# EAGLE design membership box shield (EAGLE 6.4)
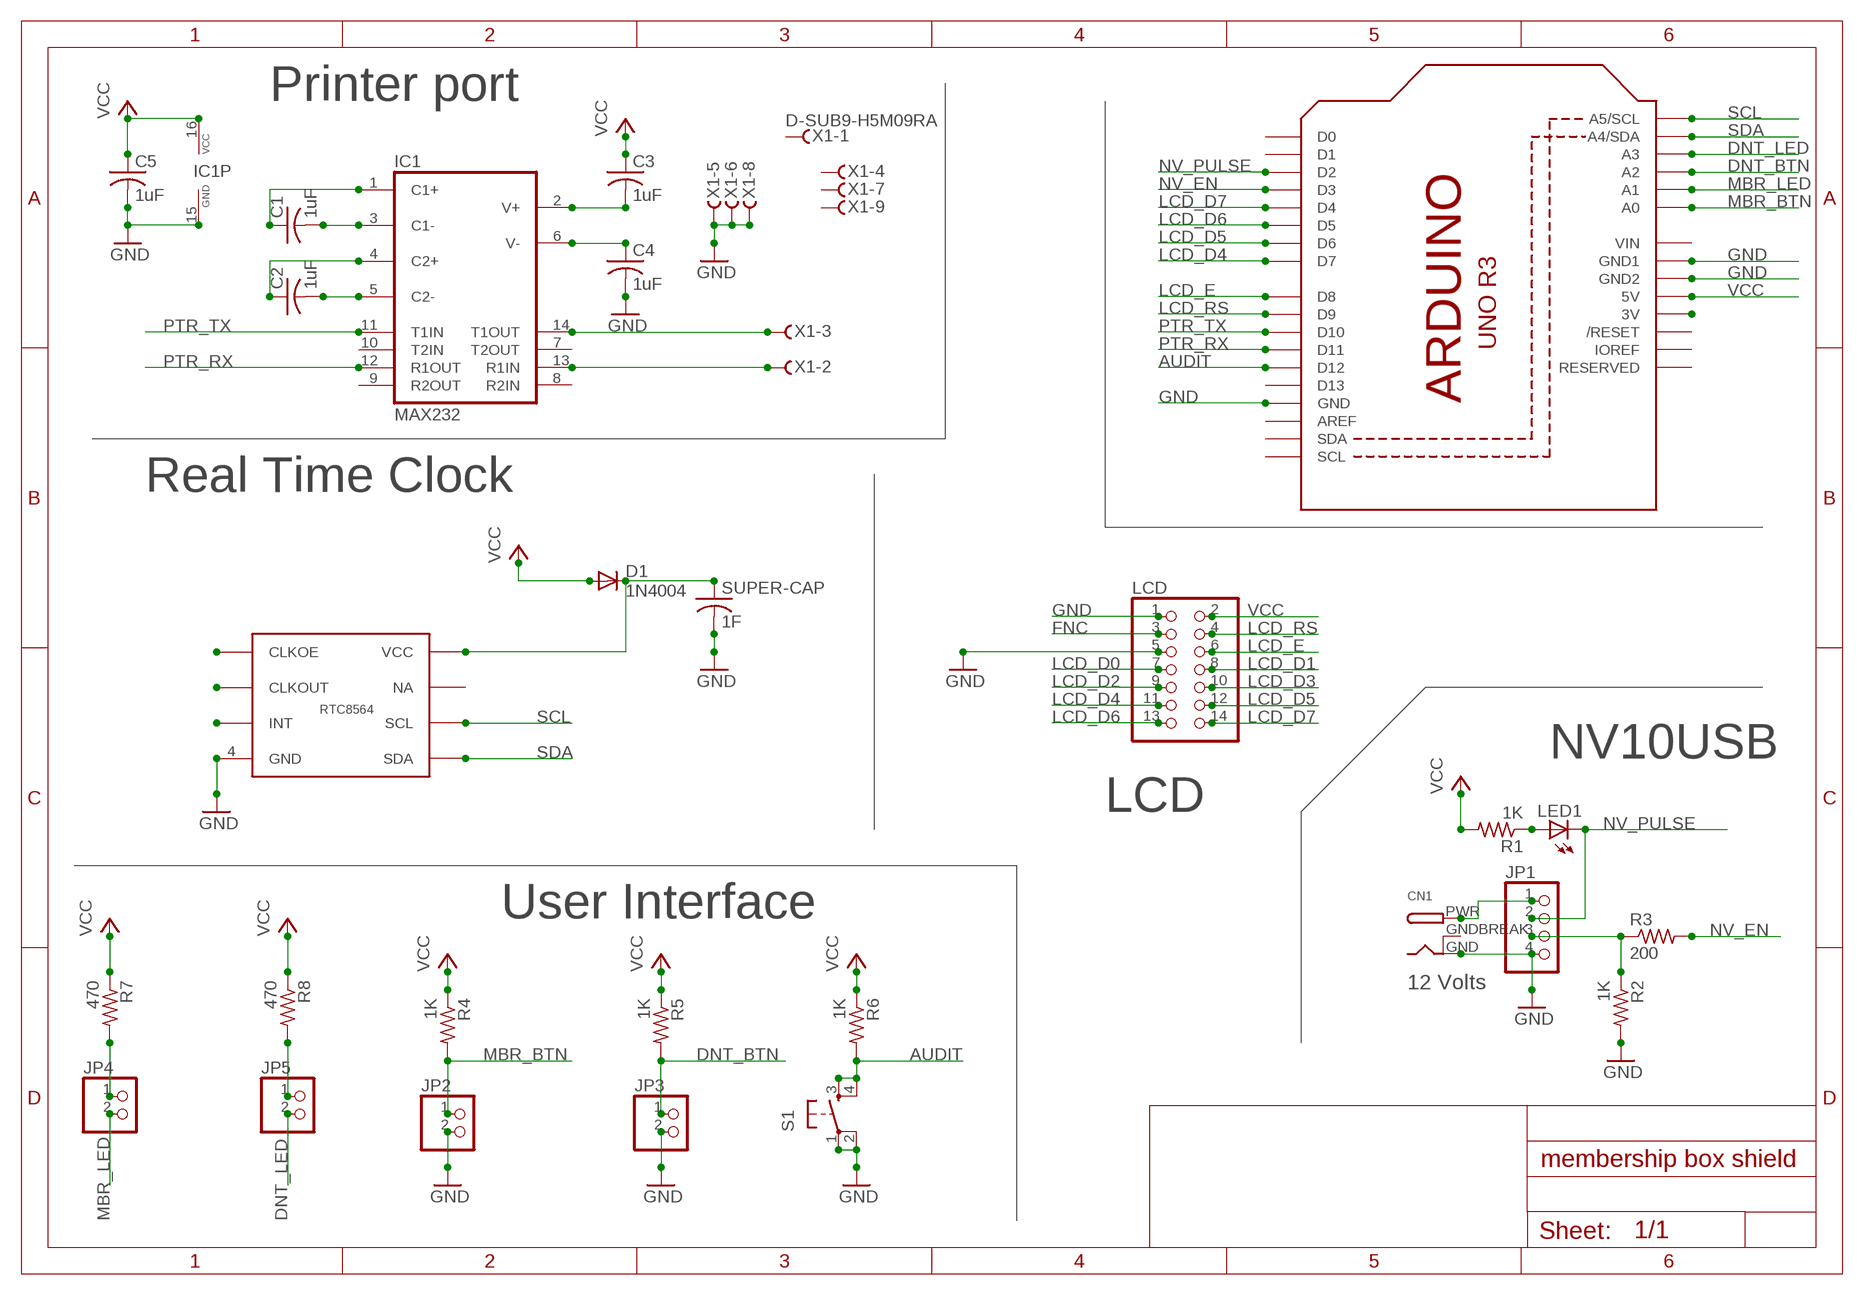
[diagram p0: schematic, sheet 1]

## Parts
C1  1uF  C-US025-024X044  [C025-024X044]
C2  1uF  C-US025-024X044  [C025-024X044]
C3  1uF  C-US025-024X044  [C025-024X044]
C4  1uF  C-US025-024X044  [C025-024X044]
C5  1uF  C-US025-024X044  [C025-024X044]
CN1  DCBARRELPTH  [DCJACK_2MM_PTH]
D1  1N4004  [DO41-10]
IC1  MAX232  [DIL16]
JP1  PINHD-1X4/90  [1X04/90]
JP2  PINHD-1X2  [1X02]
JP3  PINHD-1X2  [1X02]
JP4  PINHD-1X2  [1X02]
JP5  PINHD-1X2  [1X02]
LCD  PINHD-2X7  [2X07]
LED1  LED3MM  [LED3MM]
R1  1K  R-US_0204/2V  [0204V]
R2  1K  R-US_0204/2V  [0204V]
R3  200  R-US_0204/2V  [0204V]
R4  1K  R-US_0204/2V  [0204V]
R5  1K  R-US_0204/2V  [0204V]
R6  1K  R-US_0204/2V  [0204V]
R7  470  R-US_0204/2V  [0204V]
R8  470  R-US_0204/2V  [0204V]
RTC  RTC-8564_MODULE  [DIP-8]
S1  TAC_SWITCHPTH  [TACTILE-PTH]
SUPER-CAP  1F  C-US025-024X044  [C025-024X044]
U1  ARDUINOR3-DIMENSION  [ARDUINOR3]
X1  D-SUB9-H5M09RA  [H5M09RA]

## Nets
AUDIT: R6.2 S1.3 U1.D12
DNT_BTN: JP3.1 R5.2 U1.A2
DNT_LED: JP5.2 U1.A3
FNC: LCD.3
GND: C4.2 C5.2 CN1.GND IC1.15(GND) JP1.4 JP2.2 JP3.2 LCD.1 LCD.5 R2.2 RTC.4(GND) S1.1 S1.2 SUPER-CAP.2 U1.GND U1.GND1 U1.GND2 X1.5 X1.6 X1.8
LCD_D0: LCD.7
LCD_D1: LCD.8
LCD_D2: LCD.9
LCD_D3: LCD.10
LCD_D4: LCD.11 U1.D7
LCD_D5: LCD.12 U1.D6
LCD_D6: LCD.13 U1.D5
LCD_D7: LCD.14 U1.D4
LCD_E: LCD.6 U1.D8
LCD_RS: LCD.4 U1.D9
MBR_BTN: JP2.1 R4.2 U1.A0
MBR_LED: JP4.2 U1.A1
N$1: RTC.1(CLKOE)
N$2: RTC.2(CLKOUT)
N$3: RTC.3(INT)
N$4: JP1.3 R2.1 R3.1
N$5: C1.2 IC1.3(C1-)
N$7: LED1.A R1.1
N$8: D1.C RTC.8(VCC) SUPER-CAP.1
N$9: CN1.PWR JP1.1
N$10: C2.2 IC1.5(C2-)
N$11: IC1.13(R1IN) X1.2
N$12: JP4.1 R7.2
N$13: S1.4
N$14: JP5.1 R8.2
N$15: C1.1 IC1.1(C1+)
N$16: IC1.14(T1OUT) X1.3
N$17: C2.1 IC1.4(C2+)
N$19: C3.2 IC1.2(V+)
N$20: C4.1 IC1.6(V-)
N$24: U1.3V
NV_EN: R3.2 U1.D3
NV_PULSE: JP1.2 LED1.K(C) U1.D2
PTR_RX: IC1.12(R1OUT) U1.D11
PTR_TX: IC1.11(T1IN) U1.D10
SCL: RTC.6(SCL) U1.A5(A5/SCL)
SDA: RTC.5(SDA) U1.A4(A4/SDA)
VCC: C3.1 C5.1 D1.A IC1.16(VCC) LCD.2 R1.2 R4.1 R5.1 R6.1 R7.1 R8.1 U1.5V
Unconnected: IC1.7(T2OUT) IC1.8(R2IN) IC1.9(R2OUT) IC1.10(T2IN) RTC.7(NA) U1.AREF U1.D0 U1.D1 U1.D13 U1.IOREF U1.RESERVED U1.RESET(/RESET) U1.SCL U1.SDA X1.1 X1.4 X1.7 X1.9

## Notes on the sheet
- Printer port
- Real Time Clock
- NV10USB
- LCD
- User Interface
- 12 Volts

## Power pins joined to a net without a drawn wire
GNDBREAK: CN1.GNDBREAK
VIN: U1.VIN

## Library data of the parts
C1-C5 SUPER-CAP = adafruit:C-US: CAPACITOR, American symbol
CN1 = adafruit:DCBARREL: 2.0mm DC Barrel Jack DCJACK_2MM_PTH - Through Hole Jack (4UConnector: 05537)
D1 = adafruit:1N4004: DIODE General purpose 1N400x type rectifier (With bigger pads) http://www.ladyada.net/library/pcb/eaglelibrary.html
IC1 = maxim:MAX232: RS232 TRANSEIVER; MF: MAXIM; MPN: MAX232ACPE+; OC_FARNELL: 9723773; OC_NEWARK: 68K4544
JP1 = pinhead:PINHD-1X4: PIN HEADER
JP2-JP5 = pinhead:PINHD-1X2: PIN HEADER
LCD = pinhead:PINHD-2X7: PIN HEADER
LED1 = adafruit:LED: LED OSRAM: - CHIPLED LG R971, LG N971, LY N971, LG Q971, LY Q971, LO R971, LY R971 LH N974, LH R974 LS Q976, LO Q976, LY Q976 LO Q996 - Hyper CHIPLED LW Q18S LB Q993, LB Q99A, LB R99A - SideLED LS A670, LO A670, LY A670, LG A670, LP A670 LB A673, LV A673, LT A673, LW A673 LH A674 LY A675 LS A676, LA A676, LO A676, LY A676, LW A676 LS A679, LY A679, LG A679 - Hyper Micro SIDELED® LS Y876, LA Y876, LO Y876, LY Y876 LT Y87S - SmartLED LW L88C, LW L88S LB L89C, LB L89S, LG L890 LS L89K, LO L89K, LY L89K LS L896, LA L896, LO L896, LY L896 - TOPLED LS T670, LO T670, LY T670, LG T670, LP T670 LSG T670, LSP T670, LSY T670, LOP T670, LYG T670 LG T671, LOG T671, LSG T671 LB T673, LV T673, LT T673, LW T673 LH T674 LS T676, LA T676, LO T676, LY T676, LB T676, LH T676, LSB T676, LW T676 LB T67C, LV T67C, LT T67C, LS T67K, LO T67K, LY T67K, LW E67C LS E67B, LA E67B, LO E67B, LY E67B, LB E67C, LV E67C, LT E67C LW T67C LS T679, LY T679, LG T679 LS T770, LO T770, LY T770, LG T770, LP T770 LB T773, LV T773, LT T773, LW T773 LH T774 LS E675, LA E675, LY E675, LS T675 LS T776, LA T776, LO T776, LY T776, LB T776 LHGB T686 LT T68C, LB T68C - Hyper Mini TOPLED® LB M676 - Mini TOPLED Santana® LG M470 LS M47K, LO M47K, LY M47K Source: http://www.osram.convergy.de/
R1-R8 = adafruit:R-US_: RESISTOR, American symbol
RTC = DIY-SciB.org:RTC-8564_MODULE
S1 = SparkFun-Electromechanical:TAC_SWITCH: Momentary Switch Button commonly used for reset or general input. Spark Fun Electronics SKU : COM-00097 SMT- SWCH-08247
U1 = adafruit:ARDUINOR3: This is a new object for the new Arduino R3 - with extra pins that you may want to use (such as IOref, and duplicated A4/A5
X1 = con-thomas-betts:D-SUB9-: D-Subminiatur Connector Source: Electronioc Interconnects European Edition 1998; OC_FARNELL: unknown; OC_NEWARK: unknown

## Board
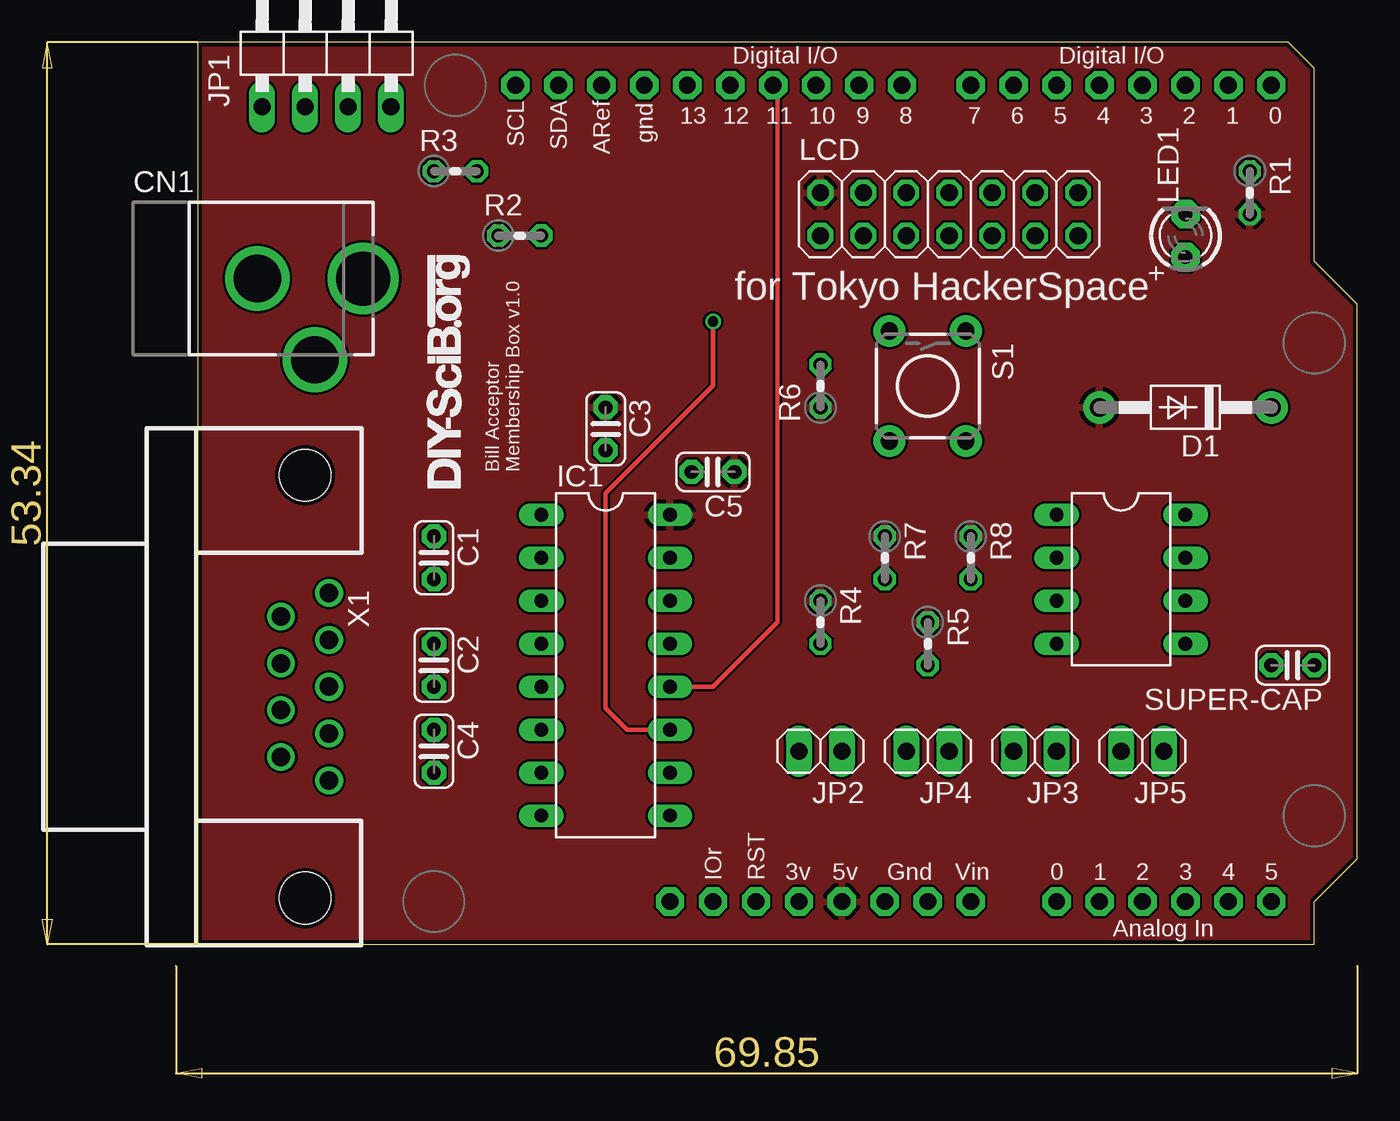
[diagram p1: board, top side]
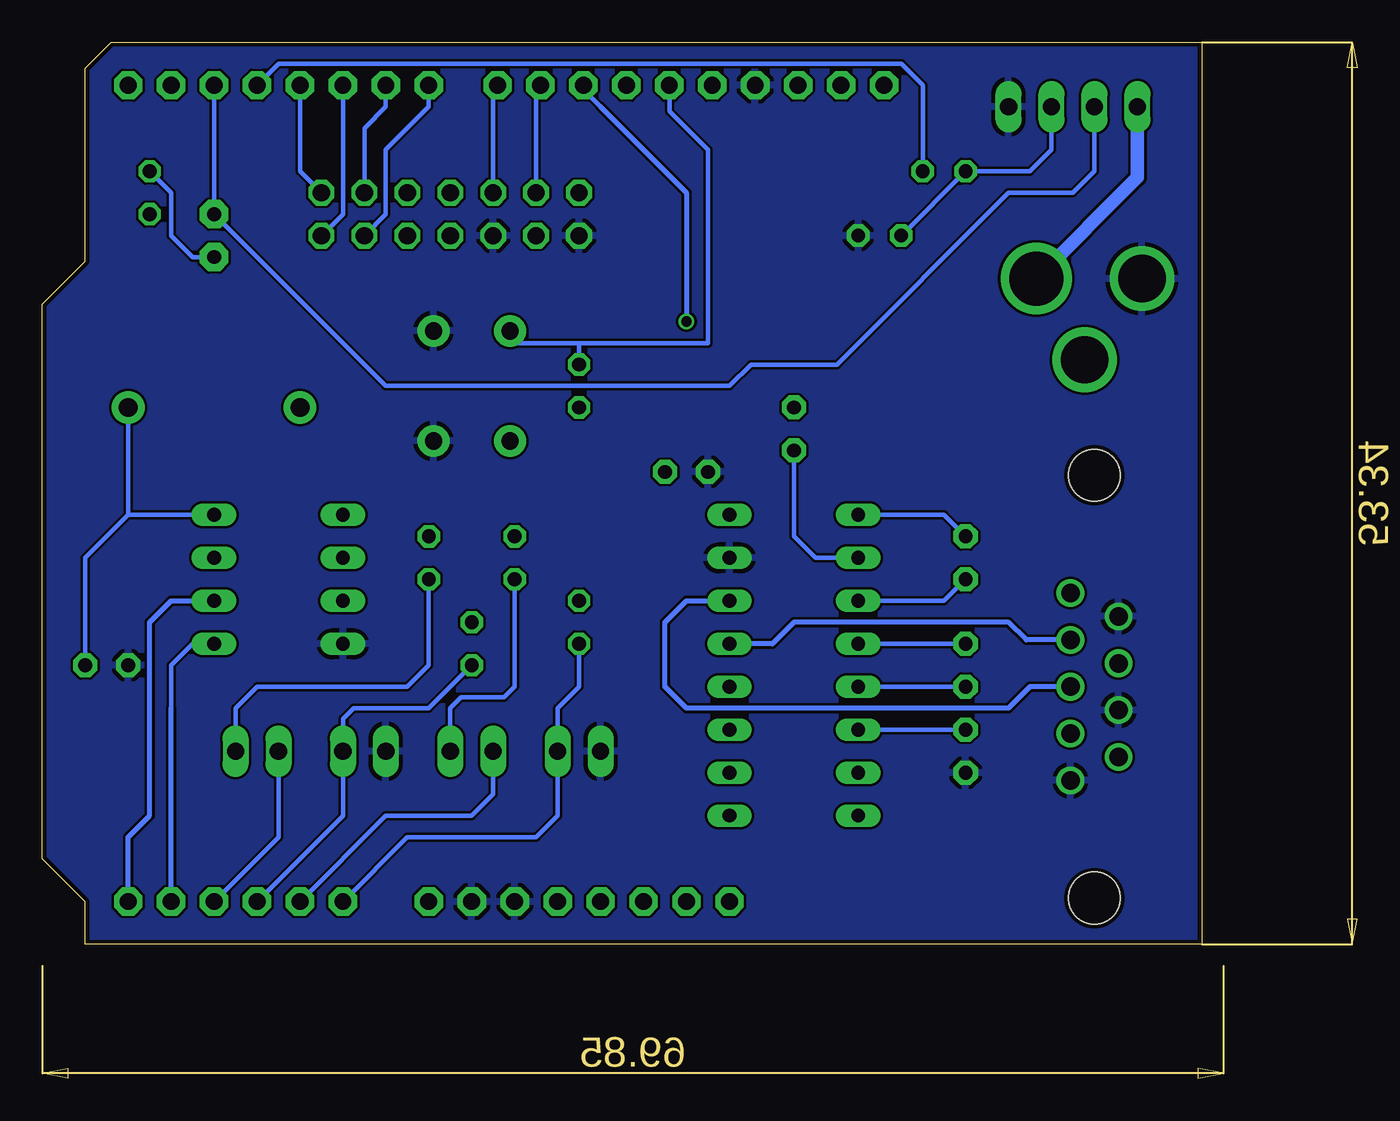
[diagram p2: board, bottom side, seen from below]

Size 68.58 x 53.34 mm. Coordinates in mm from the lower left corner, seen from the top.
Copper layers (1*16): Top 0.035mm / dielectric 1.5mm / Bottom 0.035mm
Design rules "Fusion_eagle_rule_v1.1": minimum track width 6mil, minimum drill 12mil, track to track 6mil, track to pad 6mil, pad to pad 6mil, via to via 6mil, smd to smd 0mil, copper to edge 10mil, drill to drill 10mil, minimum pad ring 10mil, minimum via ring 6mil, stop-mask expansion 2mil, vias tented up to drill 100mil, thermal gap 10mil

### Footprints (pad centres in the part's own frame; a part is rotated, then mirrored left to right if it is on the bottom)
C025-024X044 = drill 0.813 pad 1.422 octagon: 1 -1.27,0; 2 1.27,0
DCJACK_2MM_PTH = drill 2.8: GND 0,7.35; GNDBREAK 4.8,10.75 | drill 3.2: PWR 0,13.6
DO41-10 = drill 1.118 pad 1.93: A 5.08,0; C -5.08,0
DIL16 = drill 0.813 long: 1 -8.89,-3.81; 2 -6.35,-3.81; 3 -3.81,-3.81; 4 -1.27,-3.81; 5 1.27,-3.81; 6 3.81,-3.81; 7 6.35,-3.81; 8 8.89,-3.81; 9 8.89,3.81; 10 6.35,3.81; 11 3.81,3.81; 12 1.27,3.81; 13 -1.27,3.81; 14 -3.81,3.81; 15 -6.35,3.81; 16 -8.89,3.81
1X04/90 = drill 1.016 long: 1 -3.81,-3.81; 2 -1.27,-3.81; 3 1.27,-3.81; 4 3.81,-3.81
1X02 = drill 1.016 long: 1 -1.27,0; 2 1.27,0
2X07 = drill 1.016 octagon: 1 -7.62,-1.27; 2 -7.62,1.27; 3 -5.08,-1.27; 4 -5.08,1.27; 5 -2.54,-1.27; 6 -2.54,1.27; 7 0,-1.27; 8 0,1.27; 9 2.54,-1.27; 10 2.54,1.27; 11 5.08,-1.27; 12 5.08,1.27; 13 7.62,-1.27; 14 7.62,1.27
LED3MM = drill 0.813 pad 1.676 octagon: A -1.27,0; K 1.27,0
0204V = drill 0.813 octagon: 1 -1.27,0; 2 1.27,0
DIP-8 = drill 0.813 long: 1 -3.81,-3.81; 2 -1.27,-3.81; 3 1.27,-3.81; 4 3.81,-3.81; 5 3.81,3.81; 6 1.27,3.81; 7 -1.27,3.81; 8 -3.81,3.81
TACTILE-PTH = drill 1.016 pad 1.88: 1 -3.251,2.261; 2 3.251,2.261; 3 -3.251,-2.261; 4 3.251,-2.261
ARDUINOR3 = drill 1 pad 1.676 octagon: 3V 35.56,2.54; 5V 38.1,2.54; A0 50.8,2.54; A1 53.34,2.54; A2 55.88,2.54; A3 58.42,2.54; A4 60.96,2.54; A5 63.5,2.54; AREF 23.876,50.8; D0 63.5,50.8; D1 60.96,50.8; D2 58.42,50.8; D3 55.88,50.8; D4 53.34,50.8; D5 50.8,50.8; D6 48.26,50.8; D7 45.72,50.8; D8 41.656,50.8; D9 39.116,50.8; D10 36.576,50.8; D11 34.036,50.8; D12 31.496,50.8; D13 28.956,50.8; GND 26.416,50.8; GND1 43.18,2.54; GND2 40.64,2.54; IOREF 30.48,2.54; RESERVED 27.94,2.54; RESET 33.02,2.54; SCL 18.796,50.8; SDA 21.336,50.8; VIN 45.72,2.54
H5M09RA = drill 1.092: 1 -5.537,1.422; 2 -2.769,1.422; 3 0,1.422; 4 2.769,1.422; 5 5.537,1.422; 6 -4.153,-1.422; 7 -1.384,-1.422; 8 1.384,-1.422; 9 4.153,-1.422 | hole 3.048: -12.497,0; 12.497,0

### Placement (x,y rotation side)
C1  13.97,22.86 270 top
C2  13.97,16.51 270 top
C3  24.13,30.48 270 top
C4  13.97,11.43 270 top
C5  30.48,27.94 180 top
CN1  -3.81,39.37 270 top
D1  58.42,31.75 180 top
IC1  24.13,16.51 270 top
JP1  7.62,53.34 0 top
JP2  36.83,11.43 180 top
JP3  49.53,11.43 180 top
JP4  43.18,11.43 180 top
JP5  55.88,11.43 180 top
LCD  44.45,43.18 0 top
LED1  58.42,41.91 90 top
R1  62.23,44.45 270 top
R2  19.05,41.91 0 top
R3  15.24,45.72 0 top
R4  36.83,19.05 270 top
R5  43.18,17.78 270 top
R6  36.83,33.02 90 top
R7  40.64,22.86 270 top
R8  45.72,22.86 270 top
RTC  54.61,21.59 270 top
S1  43.18,33.02 270 top
SUPER-CAP  64.77,16.51 180 top
U1  0,0 0 top
U$1  [DIYSCIB.ORG-LONG]  16.51,26.67 90 top
X1  6.35,15.24 270 top

### Tracks (layer width: path | path; a pad name or v marks a point on that pad's centre or on a via)
AUDIT
  Bottom 0.254: S1.3 40.64,35.56 36.83,35.56 | 36.83,35.56 29.21,35.56 29.21,46.99 31.5,49.28 U1.D12 | R6.2 36.83,35.56
DNT_BTN
  Bottom 0.254: R5.2 45.72,13.97 50.16,13.97 50.8,13.34 JP3.1 50.8,7.62 U1.A2
DNT_LED
  Bottom 0.254: JP5.2 54.61,6.35 U1.A3
GND
  pour Bottom: -1.27,-1.27 71.12,-1.27 71.12,54.61 -1.27,54.61
LCD_D4
  Bottom 0.254: LCD.11 48.26,43.18 48.26,46.99 45.72,49.53 U1.D7
LCD_D5
  Bottom 0.254: U1.D6 48.26,49.53 49.53,48.26 LCD.12
LCD_D6
  Bottom 0.254: LCD.13 50.8,43.18 U1.D5
LCD_D7
  Bottom 0.254: U1.D4 53.34,45.72 LCD.14
LCD_E
  Bottom 0.254: LCD.6 41.91,50.8 U1.D8
LCD_RS
  Bottom 0.254: LCD.4 39.37,50.8 U1.D9
MBR_BTN
  Bottom 0.254: U1.A0 46.99,6.35 39.37,6.35 38.1,7.62 JP2.1 38.1,13.97 36.83,15.24 R4.2
MBR_LED
  Bottom 0.254: JP4.2 41.91,8.89 43.18,7.62 48.26,7.62 U1.A1
N$4
  Bottom 0.254: R2.1 R3.1 10.16,45.72 8.89,46.99 JP1.3
N$5
  Bottom 0.254: IC1.3 15.24,20.32 C1.2
N$7
  Bottom 0.254: R1.1 60.96,44.45 60.96,41.91 59.69,40.64 LED1.A
N$8
  Bottom 0.254: RTC.8 63.5,25.4 | 63.5,25.4 66.04,22.86 SUPER-CAP.1 | D1.C 63.5,25.4
N$9
  Bottom 0.813: JP1.1 3.81,45.35 CN1.PWR
N$10
  Bottom 0.254: C2.2 IC1.5
N$11
  Bottom 0.305: X1.2 10.39,18.01 11.43,19.05 24.13,19.05 25.4,17.78 IC1.13
N$12
  Bottom 0.254: JP4.1 44.45,13.97 43.81,14.61 41.27,14.61 40.64,15.24 R7.2
N$14
  Bottom 0.254: JP5.1 57.15,13.97 55.88,15.24 46.99,15.24 45.72,16.51 R8.2
N$15
  Bottom 0.254: IC1.1 15.24,25.4 C1.1
N$16
  Bottom 0.305: X1.3 10.16,15.24 11.43,13.97 30.48,13.97 31.75,15.24 31.75,19.05 30.48,20.32 IC1.14
N$17
  Bottom 0.254: C2.1 IC1.4
N$19
  Bottom 0.254: C3.2 24.13,26.67 24.13,24.13 22.86,22.86 IC1.2
N$20
  Bottom 0.254: C4.1 IC1.6
NV_EN
  Bottom 0.254: U1.D3 54.61,52.07 17.78,52.07 16.51,50.8 R3.2
NV_PULSE
  Bottom 0.254: U1.D2 LED1.K 48.26,33.02 27.94,33.02 26.67,34.29 21.59,34.29 11.43,44.45 7.62,44.45 6.35,45.72 JP1.2
PTR_RX
  Top 0.254: U1.D11 34.29,50.8 34.29,19.05 30.48,15.24 IC1.12
PTR_TX  (via drill 0.61)
  Top 0.254: v30.48,36.83 30.48,33.02 24.13,26.67 24.13,13.97 25.4,12.7 IC1.11
  Bottom 0.254: 35.56,49.53 36.83,50.8 U1.D10
  Bottom 0.305: 35.56,49.53 30.48,44.45 v30.48,36.83
SCL
  Bottom 0.305: U1.A5 63.5,5.08 63.5,6.35 62.23,7.62 62.23,19.05 61.59,19.68 60.96,20.32 RTC.6
SDA
  Bottom 0.254: RTC.5 59.69,17.78 60.96,16.51 60.96,13.97
  Bottom 0.305: U1.A4 60.96,13.97
VCC
  pour Top: -1.27,54.61 -2.54,54.61 -2.54,-1.27 69.85,-1.27 69.85,54.61

### Text on the board
tNames: for Tokyo HackerSpace | Bill Acceptor / Membership Box v1.0